# EAGLE schematic Scheme (EAGLE 9.7.0)
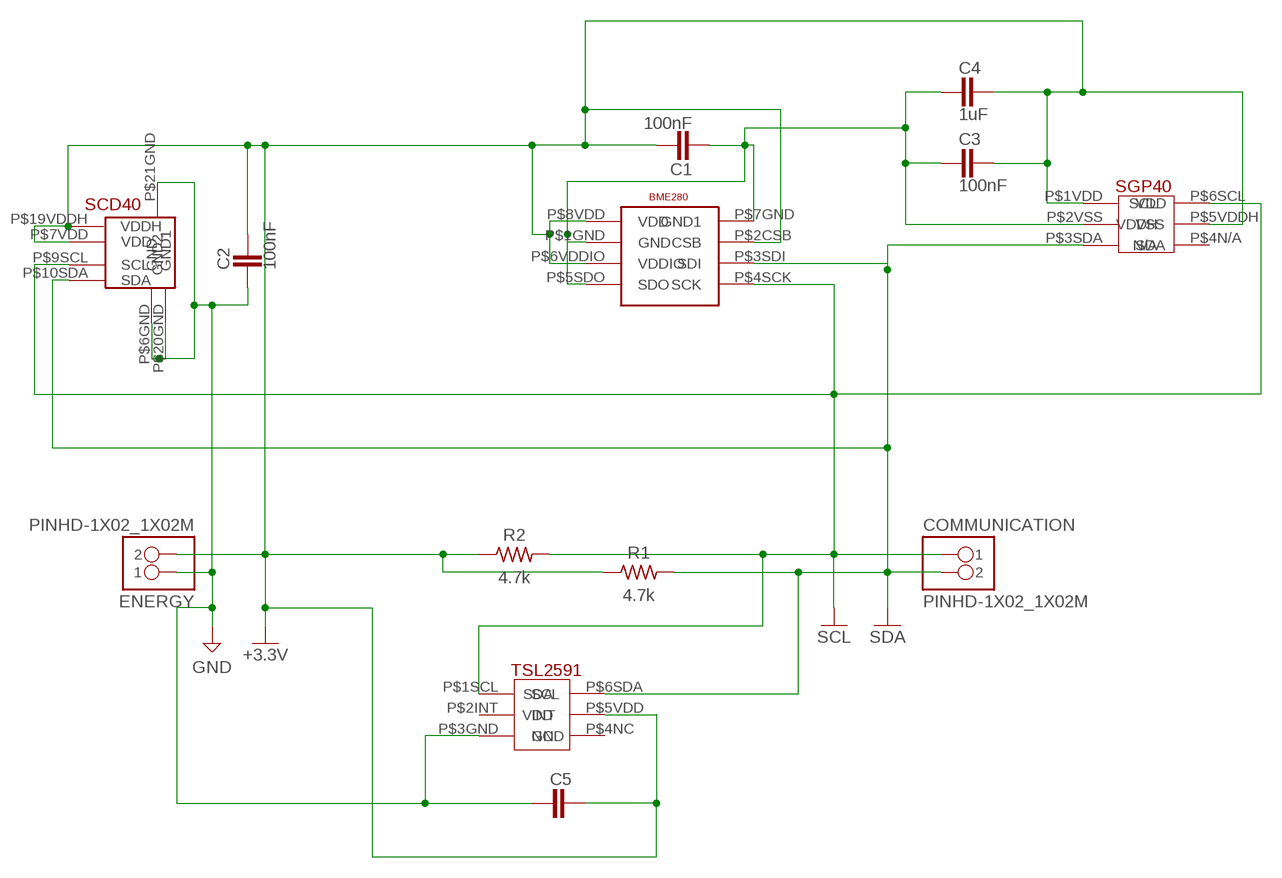
[diagram p0: schematic, sheet 1]

## Parts
BME280  BME280  [BME280]
C1  100nF  CAPACITOR_CHIP-0402(1005-METRIC)  [CAPC1005X60]
C2  100nF  CAPACITOR_CHIP-0402(1005-METRIC)  [CAPC1005X60]
C3  100nF  CAPACITOR_CHIP-0402(1005-METRIC)  [CAPC1005X60]
C4  1uF  CAPACITOR_CHIP-0402(1005-METRIC)  [CAPC1005X60]
C5  CAPACITOR_CHIP-0402(1005-METRIC)  [CAPC1005X60]
COMMUNICATION  PINHD-1X02_1X02M  [1X02]
ENERGY  PINHD-1X02_1X02M  [1X02]
R1  4.7k  R-US_CHIP-0402(1005-METRIC)  [RESC1005X40]
R2  4.7k  R-US_CHIP-0402(1005-METRIC)  [RESC1005X40]
SCD40  SCD40  [SCD40]
SGP40  SGP40  [SGP40]
TSL2591  TSL2591  [TSL2591]

## Nets
+3.3V: BME280.P$2CSB(CSB) BME280.P$6VDDIO(VDDIO) BME280.P$8VDD(VDD) C1.1 C2.1 C3.1 C4.1 C5.1 ENERGY.2 R1.1 R2.1 SCD40.P$7VDD(VDD) SCD40.P$19VDDH(VDDH) SGP40.P$1VDD(VDD) SGP40.P$5VDDH(VDDH) TSL2591.P$5VDD(VDD)
GND: C2.2 C5.2 ENERGY.1 SCD40.P$6GND(GND) SCD40.P$20GND(GND1) SCD40.P$21GND(GND2) TSL2591.P$3GND(GND)
N$9: BME280.P$1GND(GND) BME280.P$5SDO(SDO) BME280.P$7GND(GND1) C1.2 C3.2 C4.2 SGP40.P$2VSS(VSS)
SCL: BME280.P$4SCK(SCK) COMMUNICATION.1 R2.2 SCD40.P$9SCL(SCL) SGP40.P$6SCL(SCL) TSL2591.P$1SCL(SCL)
SDA: BME280.P$3SDI(SDI) COMMUNICATION.2 R1.2 SCD40.P$10SDA(SDA) SGP40.P$3SDA(SDA) TSL2591.P$6SDA(SDA)
Unconnected: SGP40.P$4N/A(N/A) TSL2591.P$2INT(INT) TSL2591.P$4NC(NC)

## Library data of the parts
BME280 = SENSORES:BME280
C1-C5 = Tinkercad:CAPACITOR: Capacitor - Generic; CATEGORY: Capacitor
COMMUNICATION ENERGY = Tinkercad:PINHD-1X02
R1 R2 = Resistor:R-US: Resistor Fixed - ANSI; CATEGORY: Resistor; SUB-CATEGORY: Fixed
SCD40 = SENSORES:SCD40
SGP40 = SENSORES:SGP40
TSL2591 = SENSORES:TSL2591